# EAGLE schematic Linux_board.va (EAGLE 5.11)
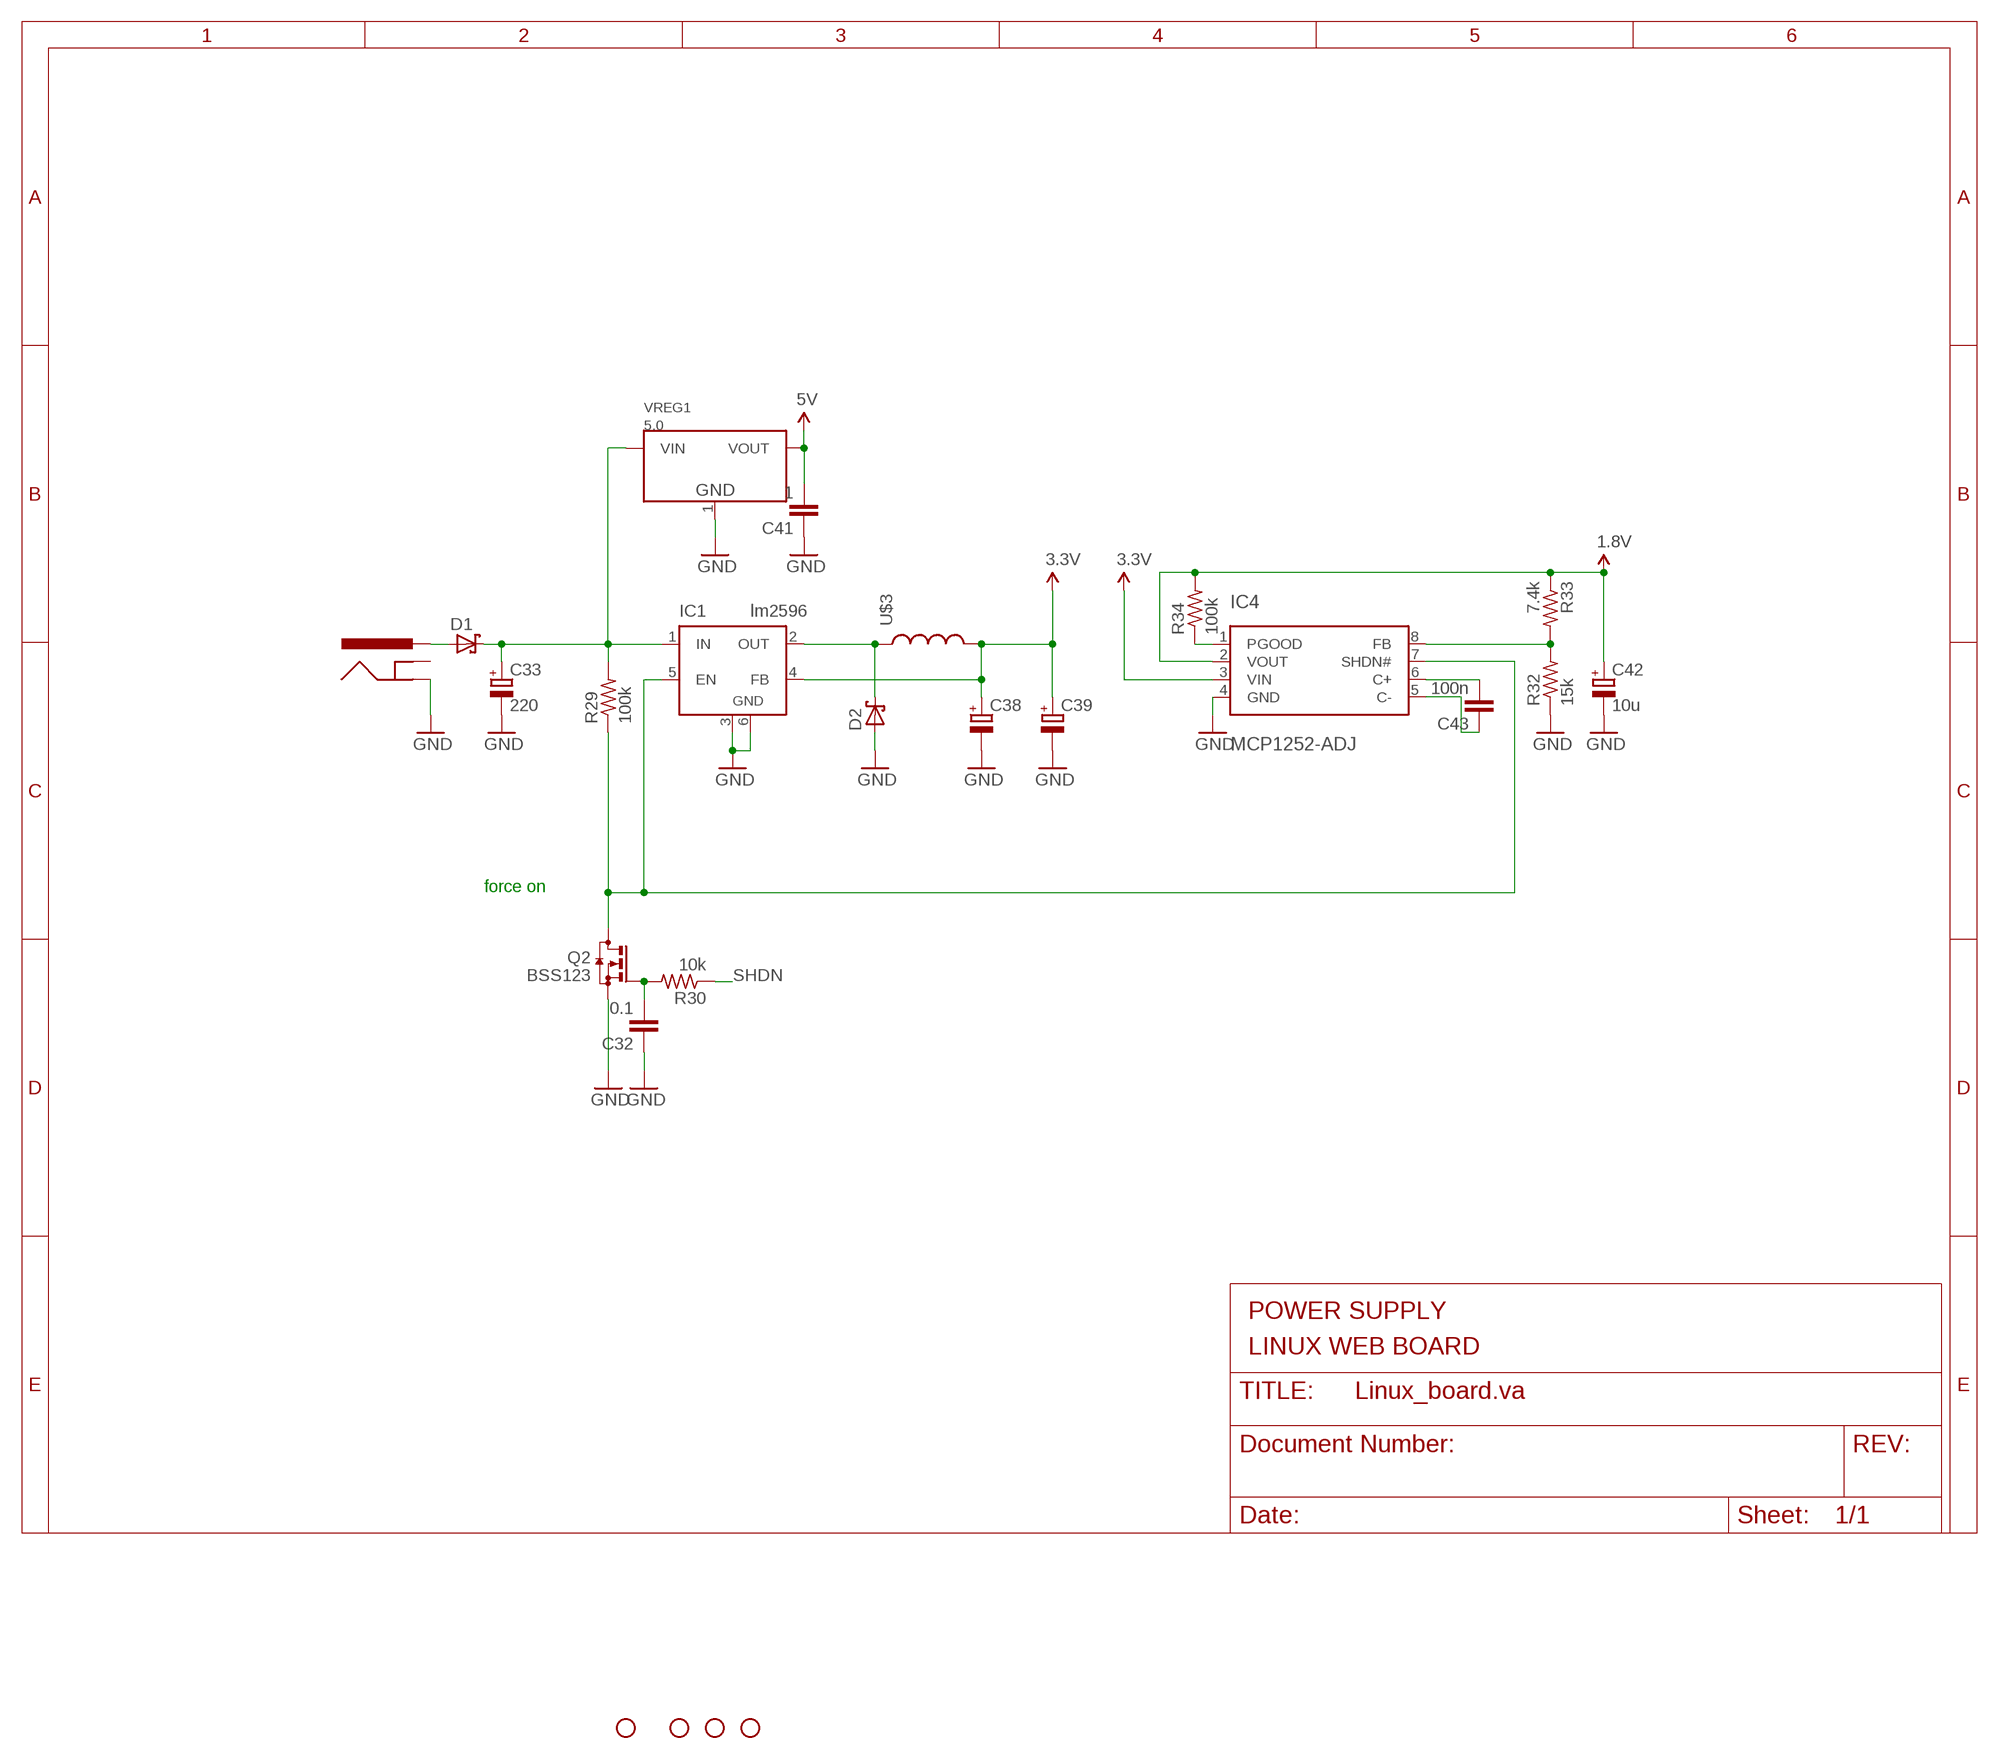
[diagram p0: schematic, sheet 1, part 1 of 3]
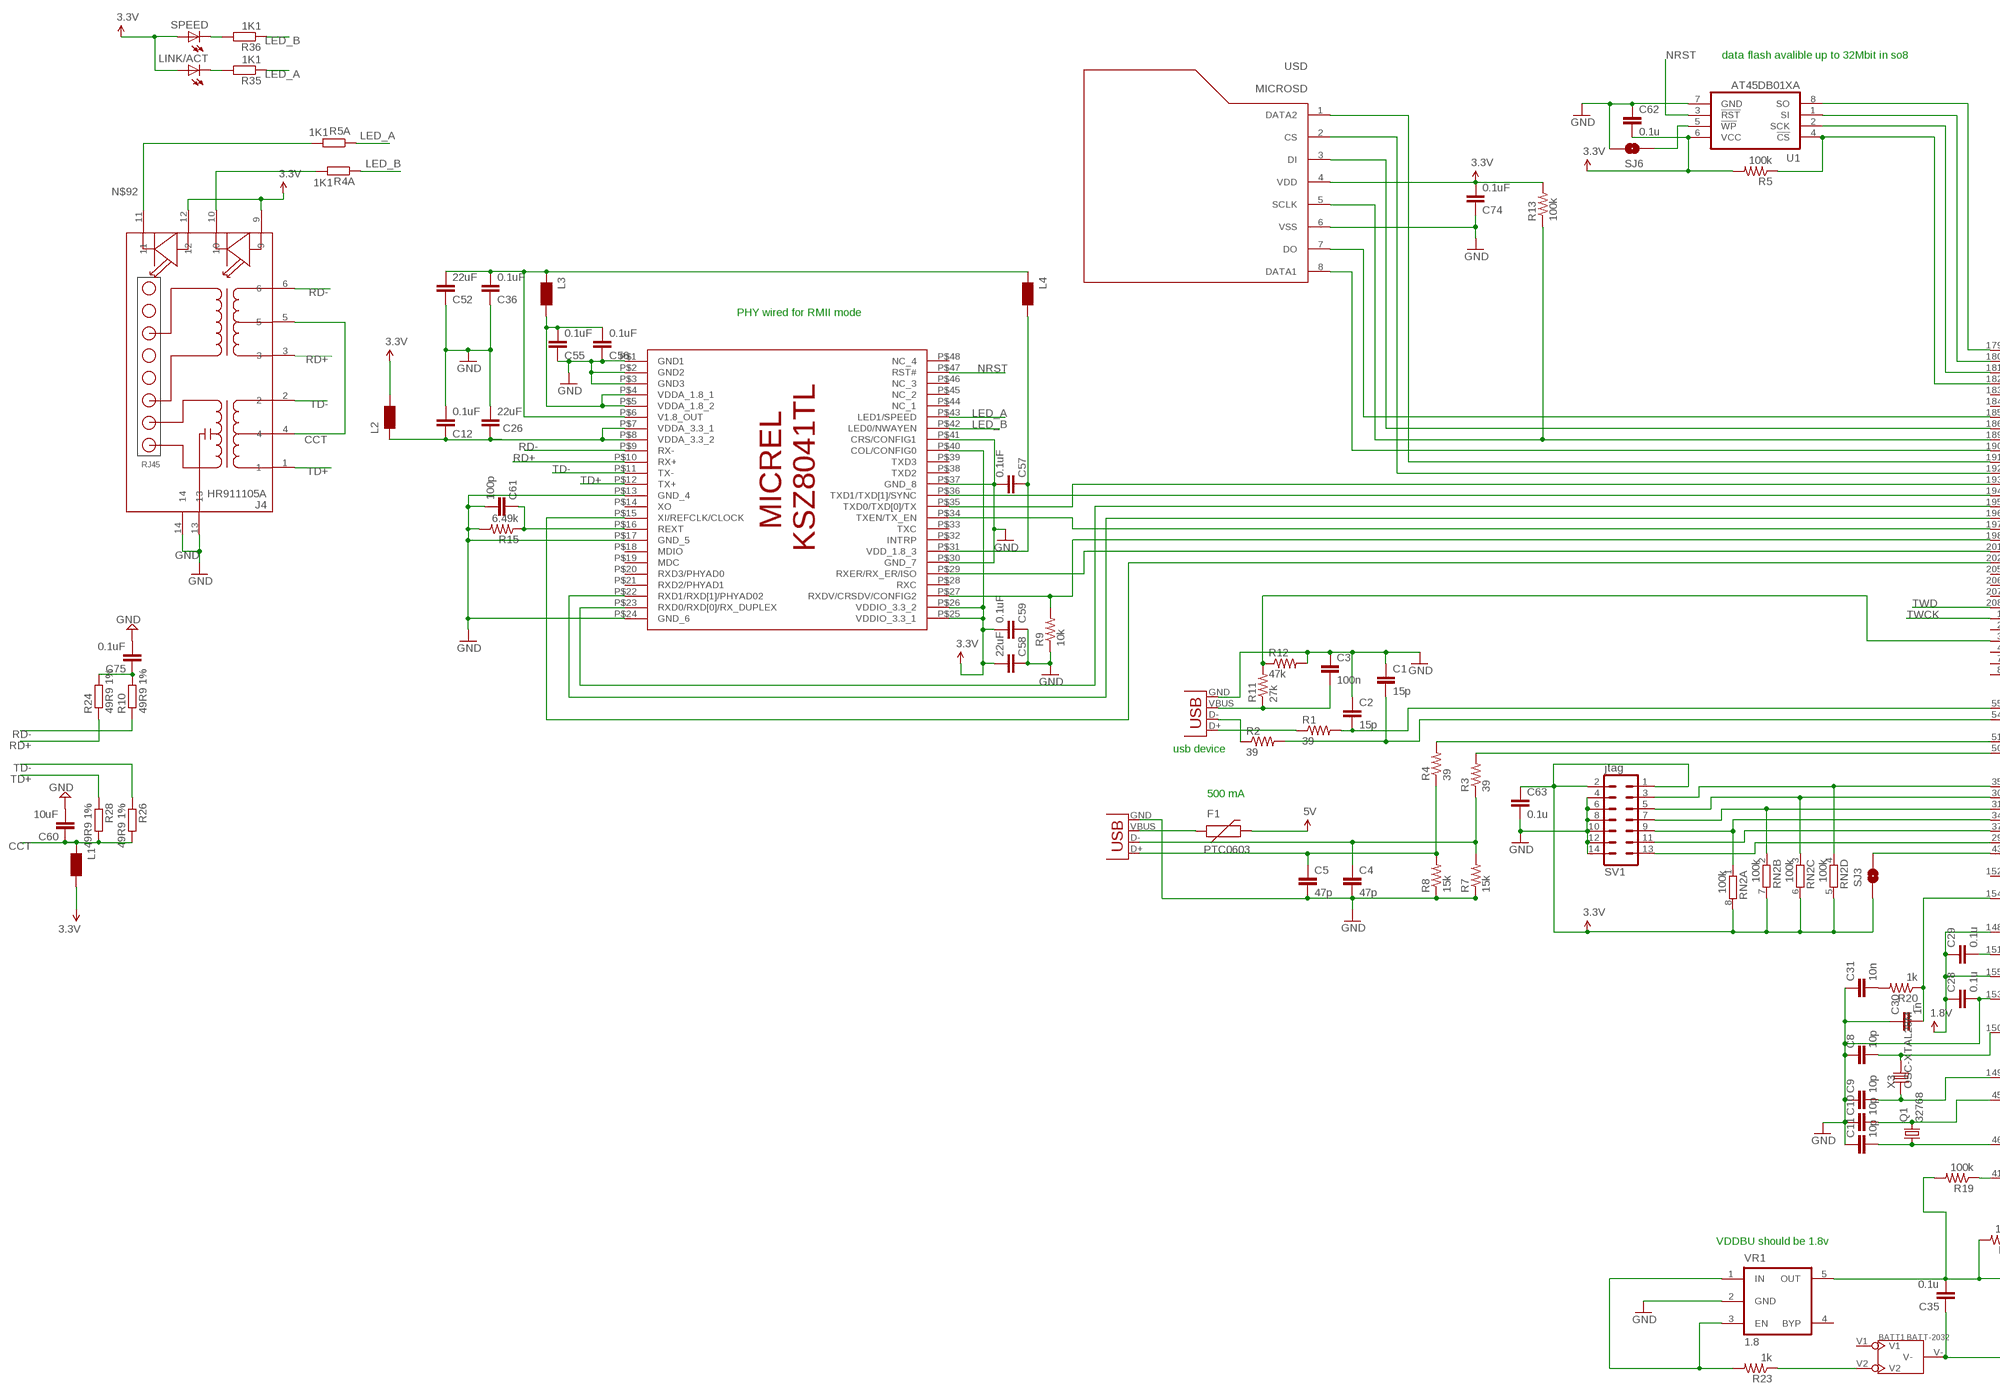
[diagram p1: schematic, sheet 1, part 2 of 3]
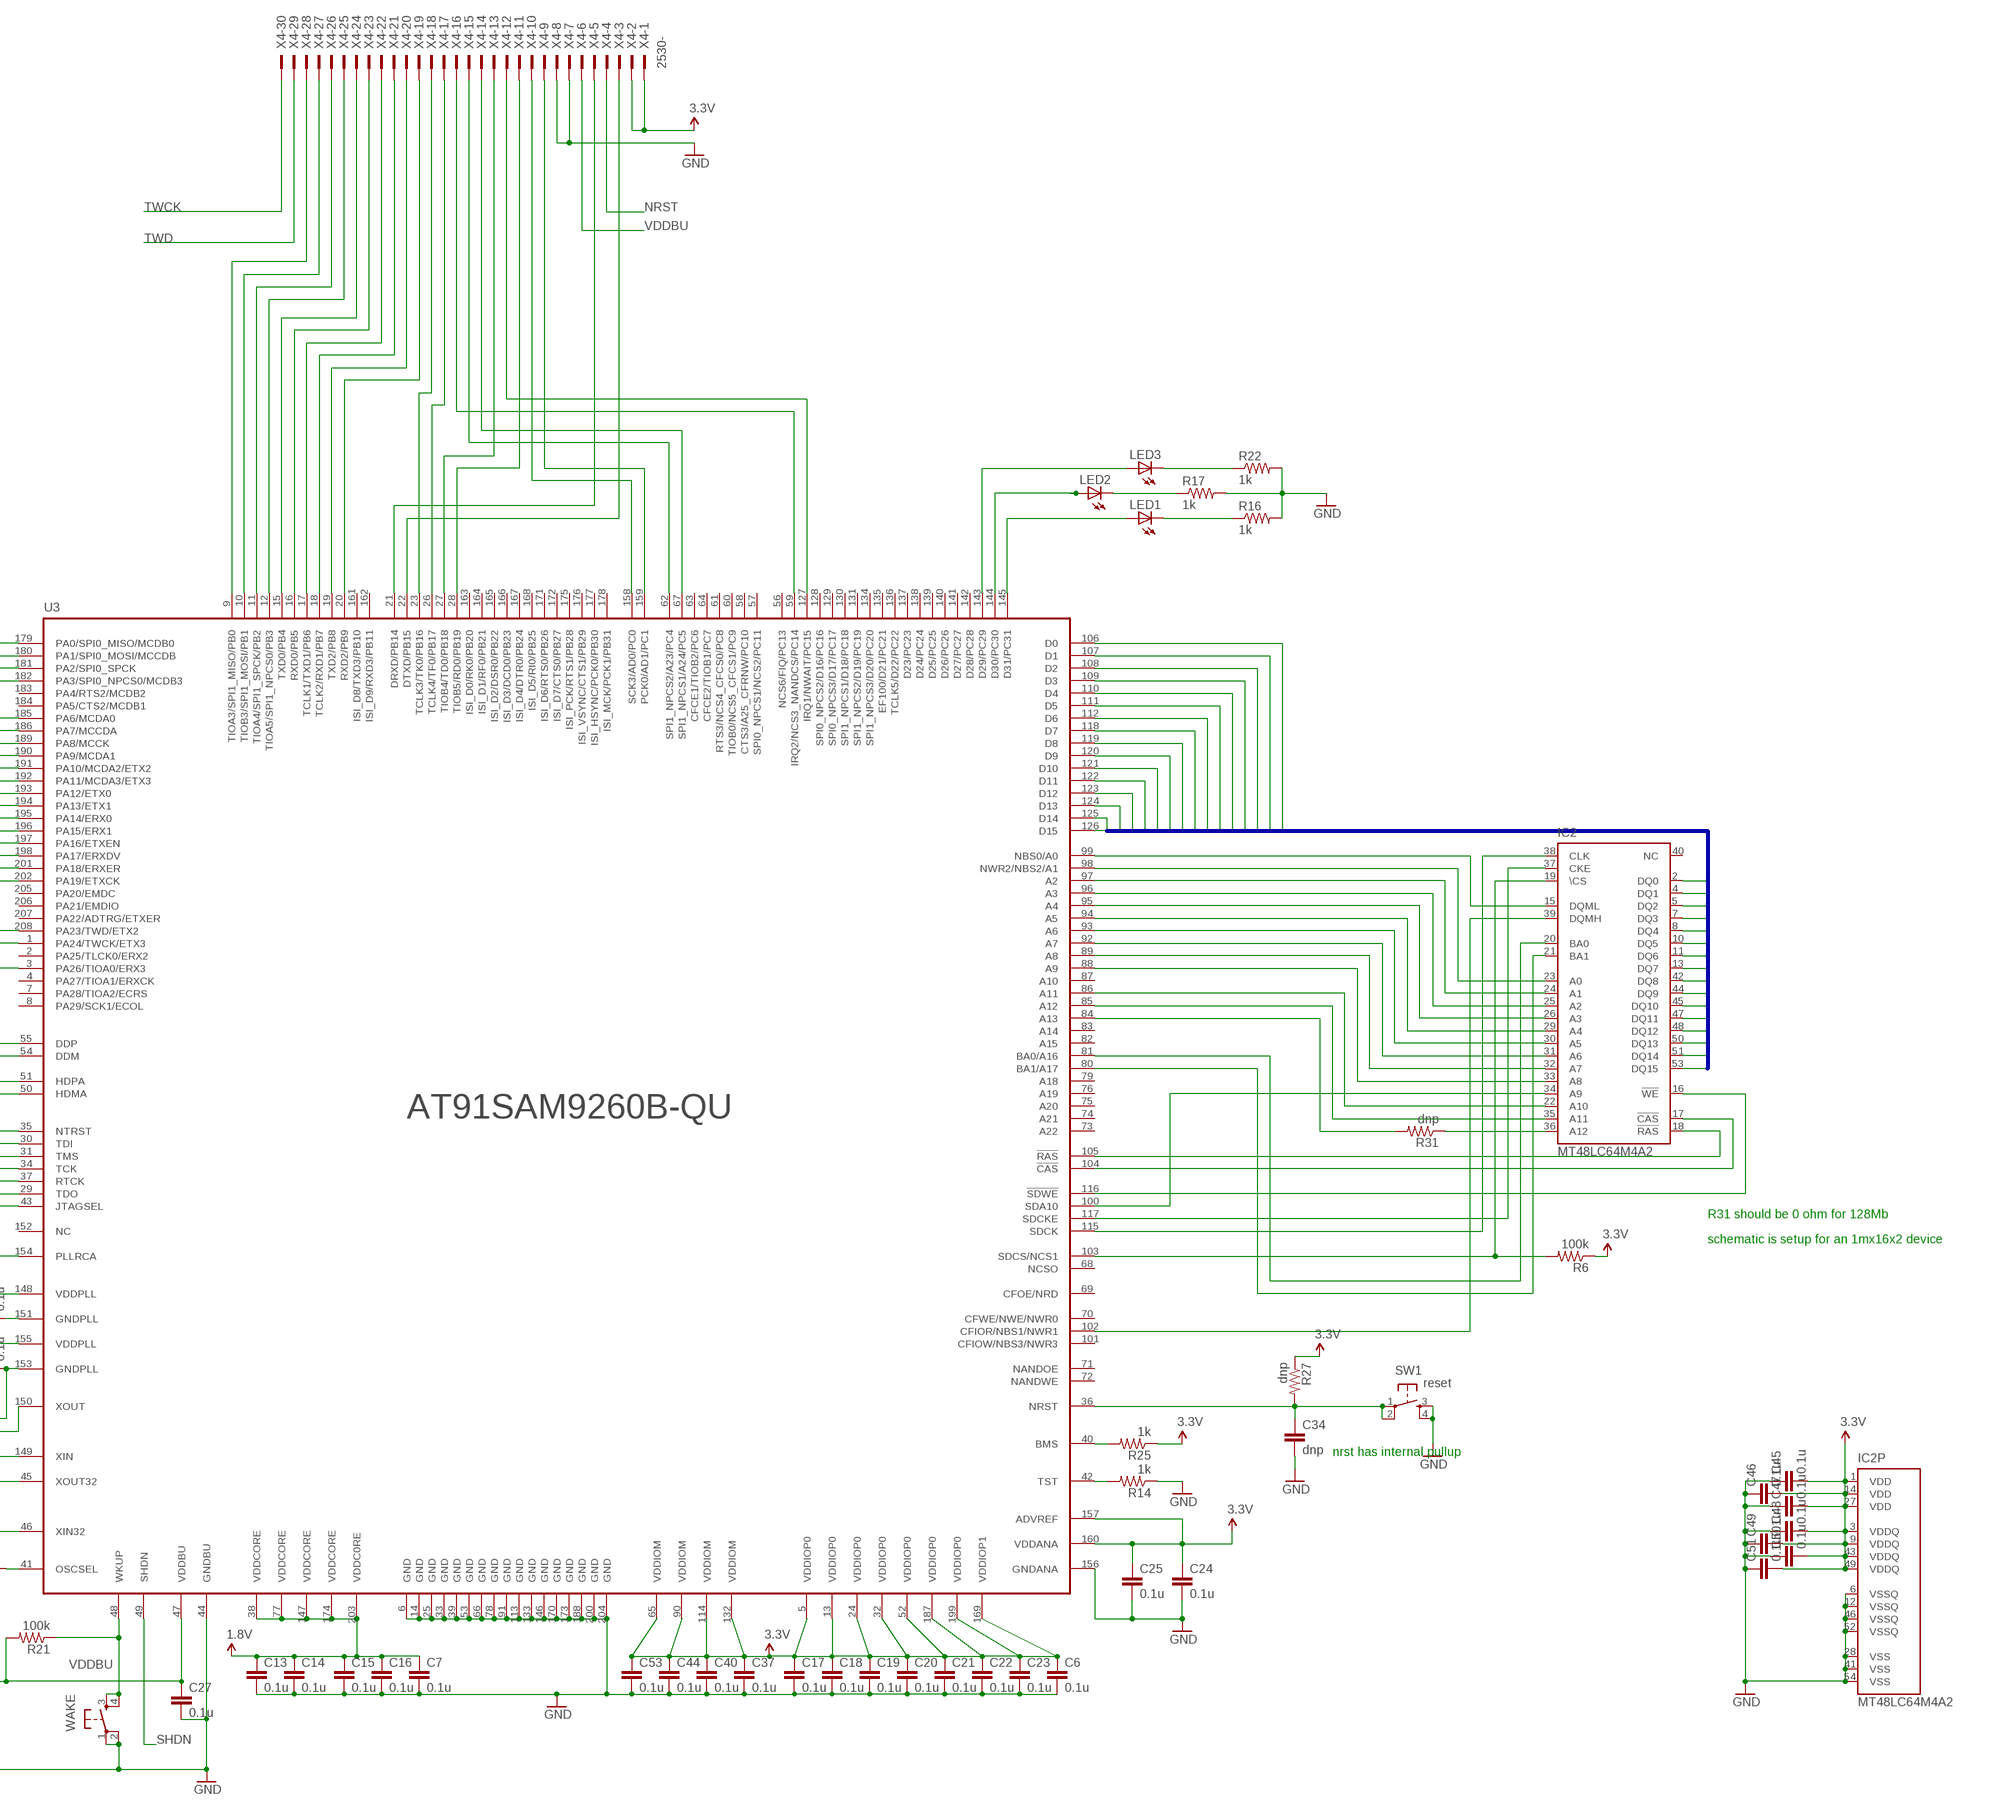
[diagram p2: schematic, sheet 1, part 3 of 3]

## Parts
BATT1  BATT-2032  [2032]
C1  15p  CAP0603-CAP  [0603-CAP]
C2  15p  CAP0603-CAP  [0603-CAP]
C3  100n  CAP0603-CAP  [0603-CAP]
C4  47p  CAP0603-CAP  [0603-CAP]
C5  47p  CAP0603-CAP  [0603-CAP]
C6  0.1u  CAP0603-CAP  [0603-CAP]
C7  0.1u  CAP0603-CAP  [0603-CAP]
C8  10p  CAP0603-CAP  [0603-CAP]
C9  10p  CAP0603-CAP  [0603-CAP]
C10  10p  CAP0603-CAP  [0603-CAP]
C11  10p  CAP0603-CAP  [0603-CAP]
C12  0.1uF  C-EUC0603  [C0603]
C13  0.1u  CAP0603-CAP  [0603-CAP]
C14  0.1u  CAP0603-CAP  [0603-CAP]
C15  0.1u  CAP0603-CAP  [0603-CAP]
C16  0.1u  CAP0603-CAP  [0603-CAP]
C17  0.1u  CAP0603-CAP  [0603-CAP]
C18  0.1u  CAP0603-CAP  [0603-CAP]
C19  0.1u  CAP0603-CAP  [0603-CAP]
C20  0.1u  CAP0603-CAP  [0603-CAP]
C21  0.1u  CAP0603-CAP  [0603-CAP]
C22  0.1u  CAP0603-CAP  [0603-CAP]
C23  0.1u  CAP0603-CAP  [0603-CAP]
C24  0.1u  CAP0603-CAP  [0603-CAP]
C25  0.1u  CAP0603-CAP  [0603-CAP]
C26  22uF  C-EUC0603  [C0603]
C27  0.1u  CAP0603-CAP  [0603-CAP]
C28  0.1u  CAP0603-CAP  [0603-CAP]
C29  0.1u  CAP0603-CAP  [0603-CAP]
C30  1n  CAP0603-CAP  [0603-CAP]
C31  10n  CAP0603-CAP  [0603-CAP]
C32  0.1  CAPC603  [C603]
C33  220  CAP_POLSMC_B  [SMC_B]
C34  dnp  CAP0603-CAP  [0603-CAP]
C35  0.1u  CAP0603-CAP  [0603-CAP]
C36  0.1uF  C-EUC0603  [C0603]
C37  0.1u  CAP0603-CAP  [0603-CAP]
C38  CAP_POLCASE_A  [CASE_A]
C39  CAP_POLSMC_B  [SMC_B]
C40  0.1u  CAP0603-CAP  [0603-CAP]
C41  1  CAPC603  [C603]
C42  10u  CAP_POLSMC_B  [SMC_B]
C43  100n  CAPC603  [C603]
C44  0.1u  CAP0603-CAP  [0603-CAP]
C45  0.1u  CAP0603-CAP  [0603-CAP]
C46  0.1u  CAP0603-CAP  [0603-CAP]
C47  0.1u  CAP0603-CAP  [0603-CAP]
C48  0.1u  CAP0603-CAP  [0603-CAP]
C49  0.1u  CAP0603-CAP  [0603-CAP]
C50  0.1u  CAP0603-CAP  [0603-CAP]
C51  0.1u  CAP0603-CAP  [0603-CAP]
C52  22uF  C-EUC0603  [C0603]
C53  0.1u  CAP0603-CAP  [0603-CAP]
C55  0.1uF  C-EUC0603  [C0603]
C56  0.1uF  C-EUC0603  [C0603]
C57  0.1uF  C-EUC0603  [C0603]
C58  22uF  C-EUC0603  [C0603]
C59  0.1uF  C-EUC0603  [C0603]
C60  10uF  C-EUC0603  [C0603]
C61  100p  C-EUC0603  [C0603]
C62  0.1u  CAP0603-CAP  [0603-CAP]
C63  0.1u  CAP0603-CAP  [0603-CAP]
C74  0.1uF  C-EUC0603  [C0603]
C75  0.1uF  C-EUC0603  [C0603]
D1  SCHOTTKY-DIODESMD  [SMB]
D2  SCHOTTKY-DIODESMD  [SMB]
F1  PTC0603  [0603]
IC1  lm2596  LM2596S  [TO263-5]
IC2  MT48LC64M4A2  [TSOP54-400]
IC4  MCP1252-ADJ  [MSOP8]
J4  HR911105A  [HR911105A]
JP1  STAND-OFF  [STAND-OFF]
JP2  STAND-OFF  [STAND-OFF]
JP3  STAND-OFF  [STAND-OFF]
JP4  STAND-OFF  [STAND-OFF]
L1  WE-KIL_0805  [WE-KI_0805_B]
L2  WE-KIL_0805  [WE-KI_0805_B]
L3  WE-KIL_0805  [WE-KI_0805_B]
L4  WE-KIL_0805  [WE-KI_0805_B]
LED1  LEDCHIPLED_0805  [CHIPLED_0805]
LED2  LEDCHIPLED_0805  [CHIPLED_0805]
LED3  LEDCHIPLED_0805  [CHIPLED_0805]
LINK/ACT  LEDCHIPLED_0805  [CHIPLED_0805]
Q1  32768  CRYSTALTC26H  [TC26H]
Q2  BSS123  [SOT23]
R1  39  R-US_R0603  [R0603]
R2  39  R-US_R0603  [R0603]
R3  39  R-US_R0603  [R0603]
R4  39  R-US_R0603  [R0603]
R4A  1K1  R-EU_R0603  [R0603]
R5  100k  R-US_R0603  [R0603]
R5A  1K1  R-EU_R0603  [R0603]
R6  100k  R-US_R0603  [R0603]
R7  15k  R-US_R0603  [R0603]
R8  15k  R-US_R0603  [R0603]
R9  10k  R-US_R0603  [R0603]
R10  49R9 1%  R-EU_R0603  [R0603]
R11  27k  R-US_R0603  [R0603]
R12  47k  R-US_R0603  [R0603]
R13  100k  R-US_R0603  [R0603]
R14  1k  R-US_R0603  [R0603]
R15  6.49k  R-US_R0603  [R0603]
R16  1k  R-US_R0603  [R0603]
R17  1k  R-US_R0603  [R0603]
R19  100k  R-US_R0603  [R0603]
R20  1k  R-US_R0603  [R0603]
R21  100k  R-US_R0603  [R0603]
R22  1k  R-US_R0603  [R0603]
R23  1k  R-US_R0603  [R0603]
R24  49R9 1%  R-EU_R0603  [R0603]
R25  1k  R-US_R0603  [R0603]
R26  49R9 1%  R-EU_R0603  [R0603]
R27  dnp  R-US_R0603  [R0603]
R28  49R9 1%  R-EU_R0603  [R0603]
R29  100k  R-US_R0603  [R0603]
R30  10k  R-US_R0603  [R0603]
R31  dnp  R-US_R0603  [R0603]
R32  15k  R-US_R0603  [R0603]
R33  7.4k  R-US_R0603  [R0603]
R34  100k  R-US_R0603  [R0603]
R35  1K1  R-EU_R0603  [R0603]
R36  1K1  R-EU_R0603  [R0603]
RN2  100k  RNETWORK  [RN8P-4R-CRA06S]
SJ3  SOLDERJUMPERNO  [SJ_2S-NO]
SJ6  SOLDERJUMPERNO  [SJ_2S-NO]
SPEED  LEDCHIPLED_0805  [CHIPLED_0805]
SV1  jtag  MA07-2  [MA07-2]
SW1  reset  SW-SMD-SMALL  [TACT_SWITCH_SMALL]
U1  AT45DB01XA  [SO08W]
U3  AT91SAM9260B-QU  [PQFP208]
U$1  KSZ8041TL  [48PIN-TQFN]
U$2  POWER_JACKSMD  [POWER_JACK_SMD]
U$3  INDUCTORPWR  [CDRH125]
USD  MICROSD  [MICROSD]
VR1  1.8  MIC5205  [SOT-23-5]
VREG1  5.0  LD1117-3.3SOT223  [SOT223]
WAKE  SW-SMD-SMALL  [TACT_SWITCH_SMALL]
X1  USB-MB-S  [USB-MB-S]
X2  USB-A-H  [USB-A-H]
X3  OSC-XTAL28M_  [5X8]
X4  2530-  [PAK100/2500-30]

## Nets
1.8V: C7.1 C13.1 C14.1 C15.1 C16.1 C28.1 C29.1 C42.+ IC4.2(VOUT) R33.1 R34.2 U3.38(VDDCORE) U3.77(VDDCORE) U3.147(VDDCORE) U3.148(VDDPLL) U3.155(VDDPLL) U3.174(VDDCORE) U3.203(VDDC0RE)
3.3V: C6.1 C17.1 C18.1 C19.1 C20.1 C21.1 C22.1 C23.1 C24.1 C25.1 C37.1 C38.+ C39.+ C40.1 C44.1 C45.2 C46.2 C47.2 C48.2 C49.2 C50.2 C51.2 C53.1 C58.1 C59.1 C62.2 C63.1 C74.1 IC1.4(FB) IC2.1(VDD) IC2.3(VDDQ) IC2.9(VDDQ) IC2.14(VDD) IC2.27(VDD) IC2.43(VDDQ) IC2.49(VDDQ) IC4.3(VIN) J4.9 J4.12 L1.1 L2.1 LINK/ACT.A R5.2 R6.1 R13.2 R25.1 R27.1 RN2.5 RN2.6 RN2.7 RN2.8 SJ3.1 SPEED.A SV1.1 SV1.2 U1.6(VCC) U3.5(VDDIOP0) U3.13(VDDIOP0) U3.24(VDDIOP0) U3.32(VDDIOP0) U3.52(VDDIOP0) U3.65(VDDIOM) U3.90(VDDIOM) U3.114(VDDIOM) U3.132(VDDIOM) U3.157(ADVREF) U3.160(VDDANA) U3.169(VDDIOP1) U3.187(VDDIOP0) U3.199(VDDIOP0) U$1.P$25(VDDIO_3.3_1) U$1.P$26(VDDIO_3.3_2) U$1.P$40(COL/CONFIG0) U$3.2 USD.4(VDD) X4.1 X4.2
5V: C41.2 F1.2 VREG1.2(VOUT)
CCT: C60.1 J4.4 J4.5 L1.2 R26.2 R28.2
D0: IC2.2(DQ0) U3.106(D0)
D1: IC2.4(DQ1) U3.107(D1)
D2: IC2.5(DQ2) U3.108(D2)
D3: IC2.7(DQ3) U3.109(D3)
D4: IC2.8(DQ4) U3.110(D4)
D5: IC2.10(DQ5) U3.111(D5)
D6: IC2.11(DQ6) U3.112(D6)
D7: IC2.13(DQ7) U3.118(D7)
D8: IC2.42(DQ8) U3.119(D8)
D9: IC2.44(DQ9) U3.120(D9)
D10: IC2.45(DQ10) U3.121(D10)
D11: IC2.47(DQ11) U3.122(D11)
D12: IC2.48(DQ12) U3.123(D12)
D13: IC2.50(DQ13) U3.124(D13)
D14: IC2.51(DQ14) U3.125(D14)
D15: IC2.53(DQ15) U3.126(D15)
GND: BATT1.V- C1.1 C2.1 C3.1 C4.2 C5.2 C6.2 C7.2 C8.1 C9.1 C10.1 C11.1 C12.1 C13.2 C14.2 C15.2 C16.2 C17.2 C18.2 C19.2 C20.2 C21.2 C22.2 C23.2 C24.2 C25.2 C26.1 C27.2 C28.2 C30.1 C31.1 C32.1 C33.- C34.2 C35.1 C36.2 C37.2 C38.- C39.- C40.2 C41.1 C42.- C44.2 C45.1 C46.1 C47.1 C48.1 C49.1 C50.1 C51.1 C52.2 C53.2 C55.2 C56.2 C57.1 C58.2 C59.2 C60.2 C61.1 C62.1 C63.2 C74.2 C75.2 D2.A IC1.3(GND) IC1.6(GND) IC2.6(VSSQ) IC2.12(VSSQ) IC2.28(VSS) IC2.41(VSS) IC2.46(VSSQ) IC2.52(VSSQ) IC2.54(VSS) IC4.4(GND) J4.13 J4.14 Q2.2(S) R7.1 R8.1 R9.1 R12.2 R14.1 R15.2 R16.2 R17.2 R22.2 R32.1 SJ6.2 SV1.4 SV1.6 SV1.8 SV1.10 SV1.12 SV1.14 SW1.3 SW1.4 U1.7(GND) U3.6(GND) U3.14(GND) U3.25(GND) U3.33(GND) U3.39(GND) U3.44(GNDBU) U3.53(GND) U3.66(GND) U3.78(GND) U3.91(GND) U3.113(GND) U3.133(GND) U3.146(GND) U3.153(GNDPLL) U3.156(GNDANA) U3.170(GND) U3.173(GND) U3.188(GND) U3.200(GND) U3.204(GND) U$1.P$1(GND1) U$1.P$2(GND2) U$1.P$3(GND3) U$1.P$13(GND_4) U$1.P$17(GND_5) U$1.P$24(GND_6) U$1.P$30(GND_7) U$1.P$37(GND_8) U$1.P$41(CRS/CONFIG1) U$2.P$4(GND) USD.6(VSS) VR1.2(GND) VREG1.1(GND) WAKE.1 WAKE.2 X1.GND X2.GND X4.7 X4.8
LED_A: R5A.1 R35.1 U$1.P$43(LED1/SPEED)
LED_B: R4A.1 R36.1 U$1.P$42(LED0/NWAYEN)
LED_SPEED: J4.10 R4A.2
N$1: RN2.4 SV1.3 U3.35(NTRST)
N$2: C10.2 Q1.2 U3.45(XOUT32)
N$3: C11.2 Q1.1 U3.46(XIN32)
N$4: C9.2 U3.149(XIN) X3.1(X1)
N$5: C8.2 U3.150(XOUT) X3.2(X2)
N$6: C29.2 U3.151(GNDPLL)
N$7: IC2.18(!RAS) U3.105(!RAS)
N$8: IC2.17(!CAS) U3.104(!CAS)
N$9: IC2.16(!WE) U3.116(!SDWE)
N$10: IC2.15(DQML) U3.99(NBS0/A0)
N$11: IC2.23(A0) U3.98(NWR2/NBS2/A1)
N$12: IC2.24(A1) U3.97(A2)
N$29: IC2.20(BA0) U3.81(BA0/A16)
N$30: IC2.21(BA1) U3.80(BA1/A17)
N$31: IC2.38(CLK) U3.115(SDCK)
N$32: IC2.25(A2) U3.96(A3)
N$33: IC2.26(A3) U3.95(A4)
N$34: U3.191(PA10/MCDA2/ETX2) USD.1(DATA2)
N$35: C5.1 R4.1 R8.2 X2.D+
N$36: R4.2 U3.51(HDPA)
N$37: SJ3.2 U3.43(JTAGSEL)
N$38: R3.2 U3.50(HDMA)
N$39: U1.2(SCK) U3.181(PA2/SPI0_SPCK)
N$40: IC1.5(EN) IC4.7(SHDN#) Q2.3(D) R29.1
N$41: U1.1(SI) U3.180(PA1/SPI0_MOSI/MCCDB)
N$42: C61.2 R15.1 U$1.P$16(REXT)
N$43: U3.23(TCLK3/TK0/PB16) X4.18
N$44: U3.26(TCLK4/TF0/PB17) X4.17
N$45: U1.8(SO) U3.179(PA0/SPI0_MISO/MCDB0)
N$46: U3.9(TIOA3/SPI1_MISO/PB0) X4.28
N$47: SV1.11 U3.37(RTCK)
N$48: RN2.3 SV1.5 U3.30(TDI)
N$49: RN2.2 SV1.7 U3.31(TMS)
N$50: RN2.1 SV1.9 U3.34(TCK)
N$52: U3.27(TIOB4/TD0/PB18) X4.13
N$53: IC2.29(A4) U3.94(A5)
N$54: IC2.30(A5) U3.93(A6)
N$55: IC2.31(A6) U3.92(A7)
N$56: IC2.32(A7) U3.89(A8)
N$57: IC2.33(A8) U3.88(A9)
N$58: IC2.34(A9) U3.100(SDA10)
N$59: IC2.22(A10) U3.86(A11)
N$60: IC2.35(A11) U3.85(A12)
N$61: R31.2 U3.84(A13)
N$62: IC2.36(A12) R31.1
N$63: R19.1 U3.41(OSCSEL)
N$64: R5.1 U1.4(!CS!) U3.182(PA3/SPI0_NPCS0/MCDB3)
N$65: U3.28(TIOB5/RD0/PB19) X4.11
N$66: C75.1 R10.2 R24.2
N$67: C12.2 C26.2 L2.2 U$1.P$7(VDDA_3.3_1) U$1.P$8(VDDA_3.3_2)
N$68: C32.2 Q2.1(G) R30.2
N$69: U3.202(PA19/ETXCK) U$1.P$15(XI/REFCLK/CLOCK)
N$70: R9.2 U3.198(PA17/ERXDV) U$1.P$27(RXDV/CRSDV/CONFIG2)
N$71: IC2.39(DQMH) U3.102(CFIOR/NBS1/NWR1)
N$72: U3.195(PA14/ERX0) U$1.P$23(RXD0/RXD[0]/RX_DUPLEX)
N$73: U3.196(PA15/ERX1) U$1.P$22(RXD1/RXD[1]/PHYAD02)
N$74: U3.201(PA18/ERXER) U$1.P$29(RXER/RX_ER/ISO)
N$75: SJ6.1 U1.5(!WP!)
N$76: U3.197(PA16/ETXEN) U$1.P$34(TXEN/TX_EN)
N$77: U3.193(PA12/ETX0) U$1.P$35(TXD0/TXD[0]/TX)
N$78: U3.194(PA13/ETX1) U$1.P$36(TXD1/TXD[1]/SYNC)
N$79: R25.2 U3.40(BMS)
N$80: LED3.A U3.143(D29/PC29)
N$81: R36.2 SPEED.C
N$82: U3.10(TIOB3/SPI1_MOSI/PB1) X4.27
N$83: R14.2 U3.42(TST)
N$84: IC2.19(\CS) R6.2 U3.103(SDCS/NCS1)
N$85: IC2.37(CKE) U3.117(SDCKE)
N$86: C55.1 C56.1 L3.1 U$1.P$4(VDDA_1.8_1) U$1.P$5(VDDA_1.8_2)
N$87: C57.2 L4.1 U$1.P$31(VDD_1.8_3)
N$88: LINK/ACT.C R35.2
N$89: C36.1 C52.1 L3.2 L4.2 U$1.P$6(V1.8_OUT)
N$90: LED2.A U3.144(D30/PC30)
N$91: R23.2 VR1.1(IN) VR1.3(EN)
N$92: J4.11 R5A.2
N$94: LED1.A U3.145(D31/PC31)
N$95: LED1.C R16.1
N$96: C1.2 R2.2 U3.54(DDM)
N$97: C2.2 R1.2 U3.55(DDP)
N$98: LED2.C R17.1
N$99: R2.1 X1.D-
N$100: R1.1 X1.D+
N$101: LED3.C R22.1
N$102: C3.2 R11.1 X1.VBUS
N$103: U3.11(TIOA4/SPI1_SPCK/PB2) X4.26
N$104: U3.12(TIOA5/SPI1_NPCS0/PB3) X4.25
N$106: BATT1.V2 R23.1
N$107: U3.190(PA9/MCDA1) USD.8(DATA1)
N$108: U3.15(TXD0/PB4) X4.24
N$109: U3.16(RXD0/PB5) X4.23
N$110: U3.17(TCLK1/TXD1/PB6) X4.22
N$111: U3.18(TCLK2/RXD1/PB7) X4.21
N$112: U3.19(TXD2/PB8) X4.20
N$113: U3.20(RXD2/PB9) X4.19
N$114: U3.158(SCK3/AD0/PC0) X4.10
N$115: U3.159(PCK0/AD1/PC1) X4.9
N$116: U3.21(DRXD/PB14) X4.5
N$117: U3.22(DTXD/PB15) X4.3
N$118: U3.62(SPI1_NPCS2/A23/PC4) X4.15
N$119: C31.2 R20.2
N$120: C30.2 R20.1 U3.154(PLLRCA)
N$121: F1.1 X2.VBUS
N$122: U3.67(SPI1_NPCS1/A24/PC5) X4.14
N$123: U3.59(IRQ2/NCS3_NANDCS/PC14) X4.16
N$124: U3.127(IRQ1/NWAIT/PC15) X4.12
N$125: SV1.13 U3.29(TDO)
N$126: D1.A U$2.VIN0(PWR)
N$127: D2.C IC1.2(OUT) U$3.1
N$130: C43.2 IC4.6(C+)
N$131: C43.1 IC4.5(C-)
N$132: IC4.8(FB) R32.2 R33.2
N$134: IC4.1(PGOOD) R34.1
N$164: R21.1 U3.48(WKUP) WAKE.3 WAKE.4
NRST: C34.1 R27.2 SW1.1 SW1.2 U1.3(!RST!) U3.36(NRST) U$1.P$47(RST#) X4.4
RD+: J4.3 R24.1 U$1.P$10(RX+)
RD-: J4.6 R10.1 U$1.P$9(RX-)
SDCLK: R13.1 U3.189(PA8/MCCK) USD.5(SCLK)
SDCS: U3.192(PA11/MCDA3/ETX3) USD.2(CS)
SDMISO: U3.185(PA6/MCDA0) USD.7(DO)
SDMOSI: U3.186(PA7/MCCDA) USD.3(DI)
SHDN: R30.1 U3.49(SHDN)
TD+: J4.1 R28.1 U$1.P$12(TX+)
TD-: J4.2 R26.1 U$1.P$11(TX-)
TWCK: U3.1(PA24/TWCK/ETX3) X4.30
TWD: U3.208(PA23/TWD/ETX2) X4.29
USB_D-: C4.1 R3.1 R7.2 X2.D-
USBDETECT: R11.2 R12.1 U3.3(PA26/TIOA0/ERX3)
VDDBU: C27.1 C35.2 R19.2 R21.2 U3.47(VDDBU) VR1.5(OUT) X4.6
VIN: C33.+ D1.C IC1.1(IN) R29.2 VREG1.3(VIN)
Unconnected: BATT1.V1 IC2.40(NC) U3.2(PA25/TLCK0/ERX2) U3.4(PA27/TIOA1/ERXCK) U3.7(PA28/TIOA2/ECRS) U3.8(PA29/SCK1/ECOL) U3.56(NCS6/FIQ/PC13) U3.57(SPI0_NPCS1/NCS2/PC11) U3.58(CTS3/A25_CFRNW/PC10) U3.60(TIOB0/NCS5_CFCS1/PC9) U3.61(RTS3/NCS4_CFCS0/PC8) U3.63(CFCE1/TIOB2/PC6) U3.64(CFCE2/TIOB1/PC7) U3.68(NCSO) U3.69(CFOE/NRD) U3.70(CFWE/NWE/NWR0) U3.71(NANDOE) U3.72(NANDWE) U3.73(A22) U3.74(A21) U3.75(A20) U3.76(A19) U3.79(A18) U3.82(A15) U3.83(A14) U3.87(A10) U3.101(CFIOW/NBS3/NWR3) U3.128(SPI0_NPCS2/D16/PC16) U3.129(SPI0_NPCS3/D17/PC17) U3.130(SPI1_NPCS1/D18/PC18) U3.131(SPI1_NPCS2/D19/PC19) U3.134(SPI1_NPCS3/D20/PC20) U3.135(EF100/D21/PC21) U3.136(TCLK5/D22/PC22) U3.137(D23/PC23) U3.138(D24/PC24) U3.139(D25/PC25) U3.140(D26/PC26) U3.141(D27/PC27) U3.142(D28/PC28) U3.152(NC) U3.161(ISI_D8/TXD3/PB10) U3.162(ISI_D9/RXD3/PB11) U3.163(ISI_D0/RK0/PB20) U3.164(ISI_D1/RF0/PB21) U3.165(ISI_D2/DSR0/PB22) U3.166(ISI_D3/DCD0/PB23) U3.167(ISI_D4/DTR0/PB24) U3.168(ISI_D5/RI0/PB25) U3.171(ISI_D6/RTS0/PB26) U3.172(ISI_D7/CTS0/PB27) U3.175(ISI_PCK/RTS1/PB28) U3.176(ISI_VSYNC/CTS1/PB29) U3.177(ISI_HSYNC/PCK0/PB30) U3.178(ISI_MCK/PCK1/PB31) U3.183(PA4/RTS2/MCDB2) U3.184(PA5/CTS2/MCDB1) U3.205(PA20/EMDC) U3.206(PA21/EMDIO) U3.207(PA22/ADTRG/ETXER) U$1.P$14(XO) U$1.P$18(MDIO) U$1.P$19(MDC) U$1.P$20(RXD3/PHYAD0) U$1.P$21(RXD2/PHYAD1) U$1.P$28(RXC) U$1.P$32(INTRP) U$1.P$33(TXC) U$1.P$38(TXD2) U$1.P$39(TXD3) U$1.P$44(NC_1) U$1.P$45(NC_2) U$1.P$46(NC_3) U$1.P$48(NC_4) U$2.GND VR1.4(BYP)

## Buses
D[0..15]

## Notes on the sheet
- force on
- POWER SUPPLY
- LINUX WEB BOARD
- data flash avalible up to 32Mbit in so8
- PHY wired for RMII mode
- usb device
- 500 mA
- R31 should be 0 ohm for 128Mb
- schematic is setup for an 1mx16x2 device
- nrst has internal pullup
- VDDBU should be 1.8v

## Library data of the parts
BATT1 = dp_devices:BATT-2032
C1-C11 C13-C25 C27-C31 C34 C35 C37 C40 C44-C51 C53 C62 C63 = SparkFun:CAP: Capacitor Standard 0603 ceramic capacitor, and 0.1" leaded capacitor.
C12 C26 C36 C52 C55-C61 C74 C75 = rcl:C-EU: CAPACITOR, European symbol
C32 C41 C43 = dp_devices:CAP
C33 C38 C39 C42 = dp_devices:CAP_POL
D1 D2 = diode:SCHOTTKY-DIODE: Schottky Diode
F1 = SparkFun:PTC: Resettable Fuse PTC Resettable Fuse. Spark Fun Electronics SKU : COM-08357
IC1 = linear:LM2596S: STEP-DOWN VOLTAGE REGULATOR
IC2 = memory-micron:MT48LC64M4A2: 256Mb: x16 SDRAM MT48LC64M4A2 - 16 Meg x 4 x 4 banks Source: http://download.micron.com/pdf/datasheets/dram/sdram/256MSDRAM.pdf
IC4 = microchip-dspic:MCP1252-ADJ: Positive-Regulated Adjustable Charge Pump
J4 = CONNECTER:HR911105A
JP1-JP4 = SparkFun:STAND-OFF: Stand Off This is the mechanical footprint for a #4 phillips button head screw. Use the keepout ring to avoid running the screw head into surrounding components. SKU : PRT-00447
L1-L4 = wuerth-elektronik:WE-KIL: SMD Wire Wound Ceramic Inductor WE-KIL - Low profile - High Q values -- Bluetooth -- Wireless LAN -- RF oscillation circuit -- IF impedance matching
LED1-LED3 LINK/ACT SPEED = led:LED: LED OSRAM: - CHIPLED LG R971, LG N971, LY N971, LG Q971, LY Q971, LO R971, LY R971 LH N974, LH R974 LS Q976, LO Q976, LY Q976 LO Q996 - Hyper CHIPLED LW Q18S LB Q993, LB Q99A, LB R99A - SideLED LS A670, LO A670, LY A670, LG A670, LP A670 LB A673, LV A673, LT A673, LW A673 LH A674 LY A675 LS A676, LA A676, LO A676, LY A676, LW A676 LS A679, LY A679, LG A679 - Hyper Micro SIDELED® LS Y876, LA Y876, LO Y876, LY Y876 LT Y87S - SmartLED LW L88C, LW L88S LB L89C, LB L89S, LG L890 LS L89K, LO L89K, LY L89K LS L896, LA L896, LO L896, LY L896 - TOPLED LS T670, LO T670, LY T670, LG T670, LP T670 LSG T670, LSP T670, LSY T670, LOP T670, LYG T670 LG T671, LOG T671, LSG T671 LB T673, LV T673, LT T673, LW T673 LH T674 LS T676, LA T676, LO T676, LY T676, LB T676, LH T676, LSB T676, LW T676 LB T67C, LV T67C, LT T67C, LS T67K, LO T67K, LY T67K, LW E67C LS E67B, LA E67B, LO E67B, LY E67B, LB E67C, LV E67C, LT E67C LW T67C LS T679, LY T679, LG T679 LS T770, LO T770, LY T770, LG T770, LP T770 LB T773, LV T773, LT T773, LW T773 LH T774 LS E675, LA E675, LY E675, LS T675 LS T776, LA T776, LO T776, LY T776, LB T776 LHGB T686 LT T68C, LB T68C - Hyper Mini TOPLED® LB M676 - Mini TOPLED Santana® LG M470 LS M47K, LO M47K, LY M47K Source: http://www.osram.convergy.de LUXEON: - LUMILED® LXK2-PW12-R00, LXK2-PW12-S00, LXK2-PW14-U00, LXK2-PW14-V00 LXK2-PM12-R00, LXK2-PM12-S00, LXK2-PM14-U00 LXK2-PE12-Q00, LXK2-PE12-R00, LXK2-PE12-S00, LXK2-PE14-T00, LXK2-PE14-U00 LXK2-PB12-K00, LXK2-PB12-L00, LXK2-PB12-M00, LXK2-PB14-N00, LXK2-PB14-P00, LXK2-PB14-Q00 LXK2-PR12-L00, LXK2-PR12-M00, LXK2-PR14-Q00, LXK2-PR14-R00 LXK2-PD12-Q00, LXK2-PD12-R00, LXK2-PD12-S00 LXK2-PH12-R00, LXK2-PH12-S00 LXK2-PL12-P00, LXK2-PL12-Q00, LXK2-PL12-R00 Source: www.luxeon.com KINGBRIGHT: KA-3528ASYC Source: www.kingbright.com
Q1 = crystal:CRYSTAL: CRYSTAL
Q2 = transistor-small-signal:BSS123: N-CHANNEL MOS FET
R1-R9 R11-R17 R19-R23 R25 R27 R29-R34 = resistor:R-US_: RESISTOR, American symbol
R4A R5A R10 R24 R26 R28 R35 R36 = rcl:R-EU_: RESISTOR, European symbol
RN2 = dp_devices:RNETWORK: 4 Resistor Array 0603
SJ3 SJ6 = SparkFun:SOLDERJUMPER: Solder Jumper Standard SMD solder jumper. Used to automate production. Two varients : Normally Open and Normally Closed are the same, but have different paste layers. NC will have a large amount of paste and should jumper during reflow.
SV1 = con-lstb:MA07-2: PIN HEADER
SW1 WAKE = dp_devices:SW-SMD-SMALL
U1 = memory-atmel:AT45DB01X: EEPROM SPI bus serial
U3 = atmel-arm:AT91SAM9260B-QU: AT91SAM9260 MCU AT91 ARM-9 Thumb Microcontroller
U$1 = micrelphy:KSZ8041TL
U$2 = SparkFun-3-2-07:POWER_JACK: Power Jack This is the standard 5.5mm barrel jack for power. The PTH is the most common, proven, reliable, footprint. All others are experimental. The Slot footprint only works if the mill layer is transmitted to the PCB fab house so be warned. Spark Fun Electronics SKU : PType-BPJ. Mating wall wart : Tools-PS
U$3 = SparkFun:INDUCTOR: Inductors Basic Inductor/Choke - 0603 and 1206. Footprints are not proven and vary greatly between part numbers.
USD = Seeed:MICROSD
VR1 = dp_devices:MIC5205: 150ma Low-Noise LDO Regulator
VREG1 = dp_devices:LD1117-3.3
X1 X2 = con-usb:USB: USB Connectors
X3 = dp_devices:OSC-XTAL2
X4 = con-3m:2530-: 3M (TM) Pak 100 4-Wall Header Source: 3M